# Altium project CPU_v1.PrjPCB (part 2 of 2)

## Sheet USB_OTG_FS.SchDoc: USB_OTG_FS
size A4; DocumentNumber: MB1246; Revision: B.1; SheetNumber: 9; SheetTotal: 17; Project: STM32H7xxI-EVAL
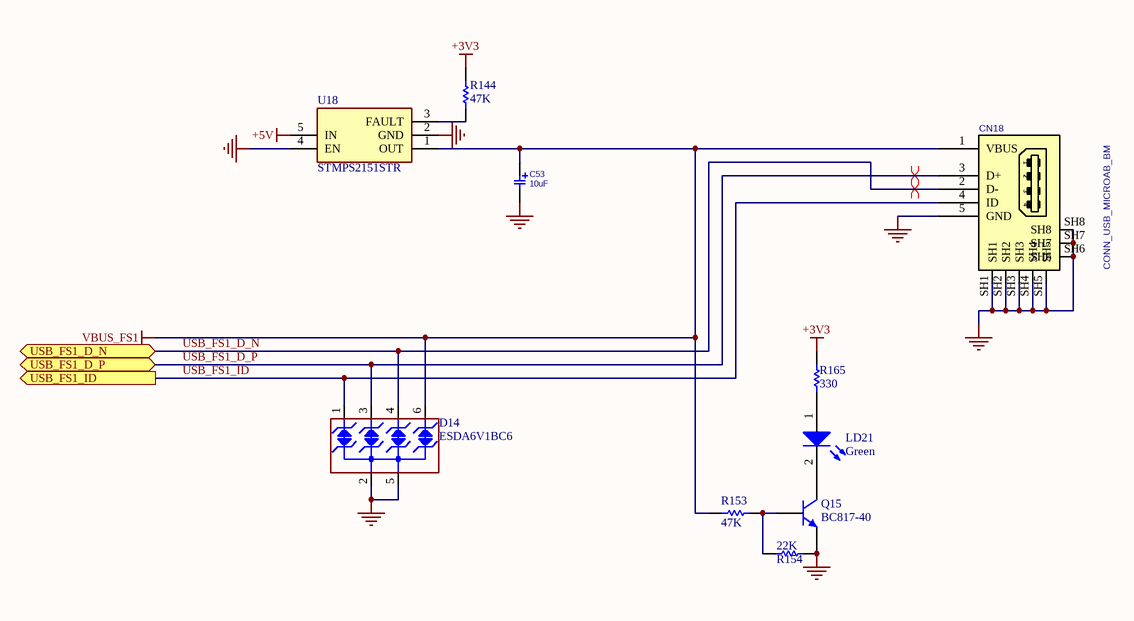
[diagram p8: USB_OTG_FS.SchDoc]

### Parts
C53  10uF  [C_TN_3216]
CN18  CONN_USB_MICROAB_BM  [USB_MICRO_AB_BM_SHT]
D14  ESDA6V1BC6  [SOT95P280X145-6N]
LD21  Green  [LED0603GRN]
Q15  BC817-40  [SOT-23-3]
R144  47K  [R0603E]
R153  47K  [R0603E]
R154  22K  [R0603E]
R165  330  [R0603E]
U18  STMPS2151STR  [SOT95P280X145-5N]

### Ports
USB_FS1_D_N (bidir), USB_FS1_D_P (bidir), USB_FS1_ID (out)

### Nets
+3V3: R144.1 R165.2
+5V: U18.5(IN)
GND: C53.2 CN18.5(GND) CN18.SH1 CN18.SH2 CN18.SH3 CN18.SH4 CN18.SH5 CN18.SH6 CN18.SH7 CN18.SH8 D14.2(IO2) D14.5(IO4) Q15.2(E) R154.1 U18.2(GND) U18.4(EN)
VBUS_FS1: C53.1 CN18.1(VBUS) D14.6(NC) R153.1 U18.1(OUT)
USB_FS1_D_N: CN18.2(D-) D14.4(IO3) ; port USB_FS1_D_N
USB_FS1_D_P: CN18.3(D+) D14.3(GND) ; port USB_FS1_D_P
USB_FS1_ID: CN18.4(ID) D14.1(IO1) ; port USB_FS1_ID
NetLD21_1: LD21.1(A) R165.1
NetLD21_2: LD21.2(K) Q15.3(C)
NetQ15_1: Q15.1(B) R153.2 R154.2
NetR144_2: R144.2 U18.3(FAULT)

### Layout directives
differential pair: USB_FS1_D_N, USB_FS1_D_P

### Notes on the sheet
- Title:
- Project:
- Size:
- Date:
- A4
- Reference:
- Sheet:
- Revision:
- of

### Library data of the parts
C53 = CAP_SMD_TAN_10uF_6.3V: CAP, SMD, TAN; PARAM: 20%, 300mOhm, -55~105oC; MANF: VISHAY; MANF_P#: T55A106M6R3C0300; PARAM2: 6.3V; PRICE: 0.46$; VALUE: 10uF
CN18 = CONN_USB_MICRO_AB_BM_SHT: CONN, USB, MICRO AB, R/A, SMD, BOTTOM MOUNT; MANF_P#: 47589-0001; MANF: MOLEX; PARAM2: 30VAC; PARAM: 1.8A, -20~85oC; MANF_P#2: HIROSE ZX62D-AB-5P8; PRICE: 0.75$; VALUE: CONN_USB_MICROAB_BM
D14 = ESDA6V1BC6: 4-line ESD protection; Manuf_1: STM; Manuf_Part_1: ESDA5V3L; Ref St: 9179034; Provided: ST; ECCN_US/EU: EAR99/NEC; Distrib: ST; Order: ESDA5V3L; Ordered by: STM
LD21 = LED2: Typical RED, GREEN, YELLOW, AMBER GaAs LED; Published: 8-Jun-2000; Revision: July-2002: Re-released for DXP Platform.; Publisher: Altium Limited
Q15 = BC817-40: TRANS NPN 300V 0.3A SOT23; Manufacturer: Micro Commercial Co; Manufacturer Part Number: MMBTA42-TP; Current Footprint: TO-236-3, SC-59, SOT-23-3; PCB Name: GS-101; Board Qty: 1000; ITEM/NO: 71; Vce Saturation (Max) @ Ib, Ic: 500mV @ 2mA, 20mA; DC Current Gain (hFE) (Min) @ Ic, Vce: 40 @ 30mA, 10V; Frequency - Transition: 50MHz; Current - Collector Cutoff (Max): 100nA (ICBO); HelpURL: D:\HNA\Datasheet Documents\MMBTA42(SOT-23).pdf; Part Number: BC817-40; Size / Dimension: NULL; Supplier: Digi-Key; Mounting Type: Surface Mount; Base Part Number: MMBTA42; Supplier Device Package: SOT-23; Part Status: Active; RoHS: RoHS Compliant; Category: Discrete Semiconductor Products; Supplier Part Number: MMBTA42TPMSCT-ND; Operating Temperature: -55°C ~ 150°C (TJ); Package / Case: TO-236-3, SC-59, SOT-23-3; Transistor Type: NPN; Packaging: Cut Tape (CT); Pricing: 1=0.22, 10=0.203, 25=0.146, 100=0.1136, 250=0.07136, 500=0.06084, 1000=0.04137 (USD); Stock: 49544
R144 R153 R154 R165 = res1: Resistor; Value: 1K; Published: 8-Jun-2000; Revision: July-2002: Re-released for DXP Platform.; Publisher: Altium Limited
U18 = STMPS2151STR: Integrated Circuit; Manufacturer_Name: ST; Datasheet Link: https://www.st.com/resource/en/datasheet/stmps2141.pdf; Height: 1.45mm; Manufacturer_Part_Number: STMPS2151STR

## Sheet MCU2_USB.SchDoc: USB_OTG_FS
size A4; DocumentNumber: MB1246; Revision: B.1; SheetNumber: 9; SheetTotal: 17; Project: STM32H7xxI-EVAL
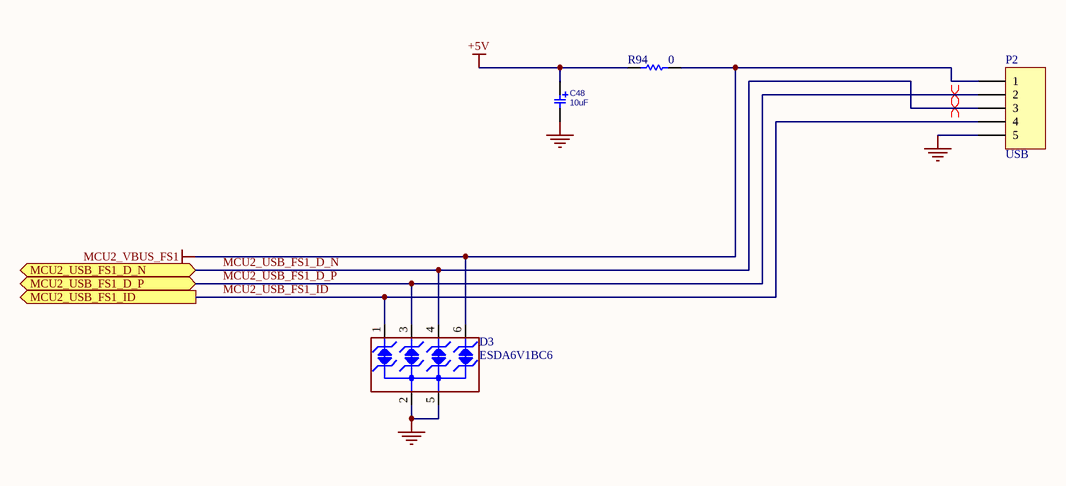
[diagram p9: MCU2_USB.SchDoc]

### Parts
C48  10uF  [C_TN_3216]
D3  ESDA6V1BC6  [SOT95P280X145-6N]
P2  USB  [xh-5]
R94  0  [R0603E]

### Ports
MCU2_USB_FS1_D_N (bidir), MCU2_USB_FS1_D_P (bidir), MCU2_USB_FS1_ID (out)

### Nets
+5V: C48.1 R94.2
GND: C48.2 D3.2(IO2) D3.5(IO4) P2.5
MCU2_VBUS_FS1: D3.6(NC) P2.1 R94.1
MCU2_USB_FS1_D_N: D3.4(IO3) P2.3 ; port MCU2_USB_FS1_D_N
MCU2_USB_FS1_D_P: D3.3(GND) P2.2 ; port MCU2_USB_FS1_D_P
MCU2_USB_FS1_ID: D3.1(IO1) P2.4 ; port MCU2_USB_FS1_ID

### Layout directives
differential pair: MCU2_USB_FS1_D_N, MCU2_USB_FS1_D_P

### Notes on the sheet
- Title:
- Project:
- Size:
- Date:
- A4
- Reference:
- Sheet:
- Revision:
- of

### Library data of the parts
C48 = CAP_SMD_TAN_10uF_6.3V: as C53 on sheet USB_OTG_FS; PRICE: 0.46$; VALUE: 10uF
D3 = ESDA6V1BC6: as D14 on sheet USB_OTG_FS; Distrib: ST; Order: ESDA5V3L; Ordered by: STM
P2 = Header 5: Header, 5-Pin; LatestRevisionDate: 17-Jul-2002; LatestRevisionNote: Re-released for DXP Platform.; Publisher: Altium Limited
R94 = Res1: Resistor; Value: 1K; Published: 8-Jun-2000; Revision: July-2002: Re-released for DXP Platform.; Publisher: Altium Limited

## Sheet GPS.SchDoc
size 254 x 228 mm; DocumentNumber: 12; SheetNumber: 12; SheetTotal: 15; PageSetup: Record=PageOptions|CenterHorizontal=True|CenterVertical=True|PrintScale=0.87|XCorrection=1.00|YCorrection=1.00|PrintKind=1|BorderSize=5000000|LeftOffset=0|BottomOffset=0|Orientation=2|PaperLength=1000|PaperWidth=1000|Scale=100|PaperSource=257|PrintQuality=600|MediaType=1|DitherType=10|PrintScaleMode=1|PaperKind=A4|PaperIndex=9
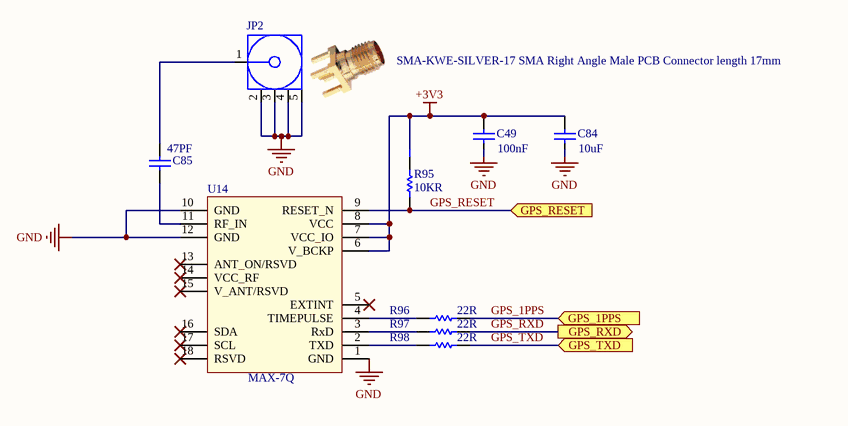
[diagram p10: GPS.SchDoc]

### Parts
C49  100nF  [C0603E]
C84  10uF  [C0805E]
C85  47PF  [C0603E]
JP2  SMA-KWE-SILVER-17 SMA Right Angle Male PCB Connector length 17mm  [SMA_R]
R95  10KR  [R0603E]
R96  22R  [R0603E]
R97  22R  [R0603E]
R98  22R  [R0603E]
U14  Part Number: MAX-7Q  [MAX]  (hidden comment: GPS_MAX-7Q)

### Ports
GPS_1PPS (in), GPS_RESET (in), GPS_RXD (out), GPS_TXD (in)

### Nets
+3V3: C49.1 C84.1 R95.2 U14.6(V_BCKP) U14.7(VCC_IO) U14.8(VCC)
GND: C49.2 C84.2 JP2.2(GND) JP2.3(GND) JP2.4(GND) JP2.5(GND) U14.1(GND) U14.10(GND) U14.12(GND)
GPS_1PPS: R96.2 ; port GPS_1PPS
GPS_RESET: R95.1 U14.9(RESET_N) ; port GPS_RESET
GPS_RXD: R97.2 ; port GPS_RXD
GPS_TXD: R98.2 ; port GPS_TXD
NetC85_1: C85.1 JP2.1(Signal)
NetC85_2: C85.2 U14.11(RF_IN)
NetR96_1: R96.1 U14.4(TIMEPULSE)
NetR97_1: R97.1 U14.3(RxD)
NetR98_1: R98.1 U14.2(TXD)

Not connected (* = marked no-connect by the designer): U14 5(EXTINT)* 13(ANT_ON/RSVD)* 14(VCC_RF)* 15(V_ANT/RSVD)* 16(SDA)* 17(SCL)* 18(RSVD)*

### Library data of the parts
C49 C85 = Cap: Chip Monolithic Ceramic Capacitor; SMD; Manufacturer: Murata Electronics North America; Manufacturer Part Number: GRM188R71C104KA01D; Current Footprint: 0603 (1608 Metric); Board Qty: 100; PCB Name: Main_PCB; Packing List: CL10B104KB8NNNC; ComponentLink1Description: Datasheet; HelpURL: D:\HNA\Datasheet Documents\c02e.pdf; ComponentLink1URL: D:\HNA\Datasheet Documents\c02e.pdf; Mounting Type: Surface Mount; Supplier: NULL; Supplier Part Number: NULL; Pricing: NULL; Package / Case: 0603 (1608 Metric); Size / Dimension: NULL; Description1: Chip Monolithic Ceramic Capacitor; SMD
  C49: Part Number: 100nF
  C85: Part Number: 47PF
C84 = Cap: Chip Monolithic Ceramic Capacitor; SMD; Manufacturer: Murata Electronics North America; Manufacturer Part Number: GRM188R71C104KA01D; Current Footprint: 0805 (2012 Metric); Board Qty: 100; PCB Name: Main_PCB; Packing List: CL10B104KB8NNNC; ComponentLink1Description: Datasheet; HelpURL: D:\HNA\Datasheet Documents\c02e.pdf; ComponentLink1URL: D:\HNA\Datasheet Documents\c02e.pdf; Mounting Type: Surface Mount; Supplier: NULL; Part Number: 10uF; Supplier Part Number: NULL; Pricing: NULL; Package / Case: 0805 (2012 Metric); Size / Dimension: NULL; Description1: Chip Monolithic Ceramic Capacitor; SMD
JP2 = 19-46-2-TGG: CONN RP-SMA JACK R/A 50 OHM PCB MALE PIN-SILVER; Manufacturer-1: Linx Technologies Inc.; Manufacturer Part Number-1: CONREVSMA002-L; Manufacturer: China; Manufacturer Part Number: SMA-KWE-17 SMA Right Angle Male PCB Connector length 17mm; Current Footprint: THD; Board Qty: 100; Impedance: 50 Ohm; Contact Termination: Solder; Connector Type: Receptacle, Male Pin; Center Contact Material: Brass; Body Finish: Nickel; Dielectric Material: Polytetrafluoroethylene (PTFE); Center Contact Plating: Gold; Package / Case: THD; Part Number-1: CONREVSMA002-L; Pricing: 1=4.12, 25=3.8, 100=3.43, 500=3.25 (USD); Supplier: Digi-Key; Supplier Part Number: CONREVSMA002-L-ND; HelpURL: D:\HNA\Datasheet Documents\conrevsma002-l.pdf; Category: Connectors, Interconnects; RoHS: RoHS Compliant; Packaging: Bulk; Part Status: Active; Connector Style: RP-SMA; Frequency - Max: -; Mounting Type: Panel Mount, Bulkhead; Through Hole, Right Angle; Features: -; Housing Color: Silver; Cable Group: -; Shield Termination: Solder; Fastening Type: Threaded; Voltage Rating: -; Ingress Protection: -; Operating Temperature: -65°C ~ 165°C; Body Material: Brass; Stock: 11366; Part Number: SMA-KWE-SILVER-17 SMA Right Angle Male PCB Connector length 17mm
R95-R98 = Res1: Resistor: thick film; SMD; Manufacturer: Yageo; Manufacturer Part Number: null; Current Footprint: 0603 (1608 Metric); Board Qty: 100; PCB Name: Main_PCB; Packing List: 0603F1002T5E; ComponentLink1Description: Datasheet; HelpURL: D:\HNA\Datasheet Documents\PYu-RC_Group_51_RoHS_L_0.pdf; ComponentLink1URL: D:\HNA\Datasheet Documents\PYu-RC_Group_51_RoHS_L_0.pdf; Mounting Type: Surface Mount; Supplier: NULL; Supplier Part Number: NULL; Pricing: NULL; Description1: Resistor: thick film; SMD; Package / Case: 0603 (1608 Metric); Size / Dimension: NULL
  R95: Part Number: 10KR
  R96-R98: Part Number: 22R
U14 = MAX: GPS chip module EPP0910; Manufacturer-1: ShenZhen Tifull Technology Ltd.; Manufacturer Part Number-1: TF1097U7M3; Manufacturer: NULL; Current Footprint: SMD; PCB Name: Main_PCB; Package / Case: SMD; Part Number-1: MAX-7Q; Pricing: 1=12.00000, 100=12.00000 (USD); Size / Dimension: NULL; Supplier: Octopart; Supplier Part Number: Seeed Studio - 317050009; HelpURL: D:\HNA\Datasheet Documents\u-blox-MAX-7_DataSheet_(GPS.G7-HW-12012)_2.pdf; Part Number-2: TF1097U7M3; Manufacturer Part Number: NULL

## Sheet LCDTFT_FPC45P_RGB.SchDoc
size A3; SheetNumber: 14; SheetTotal: 27
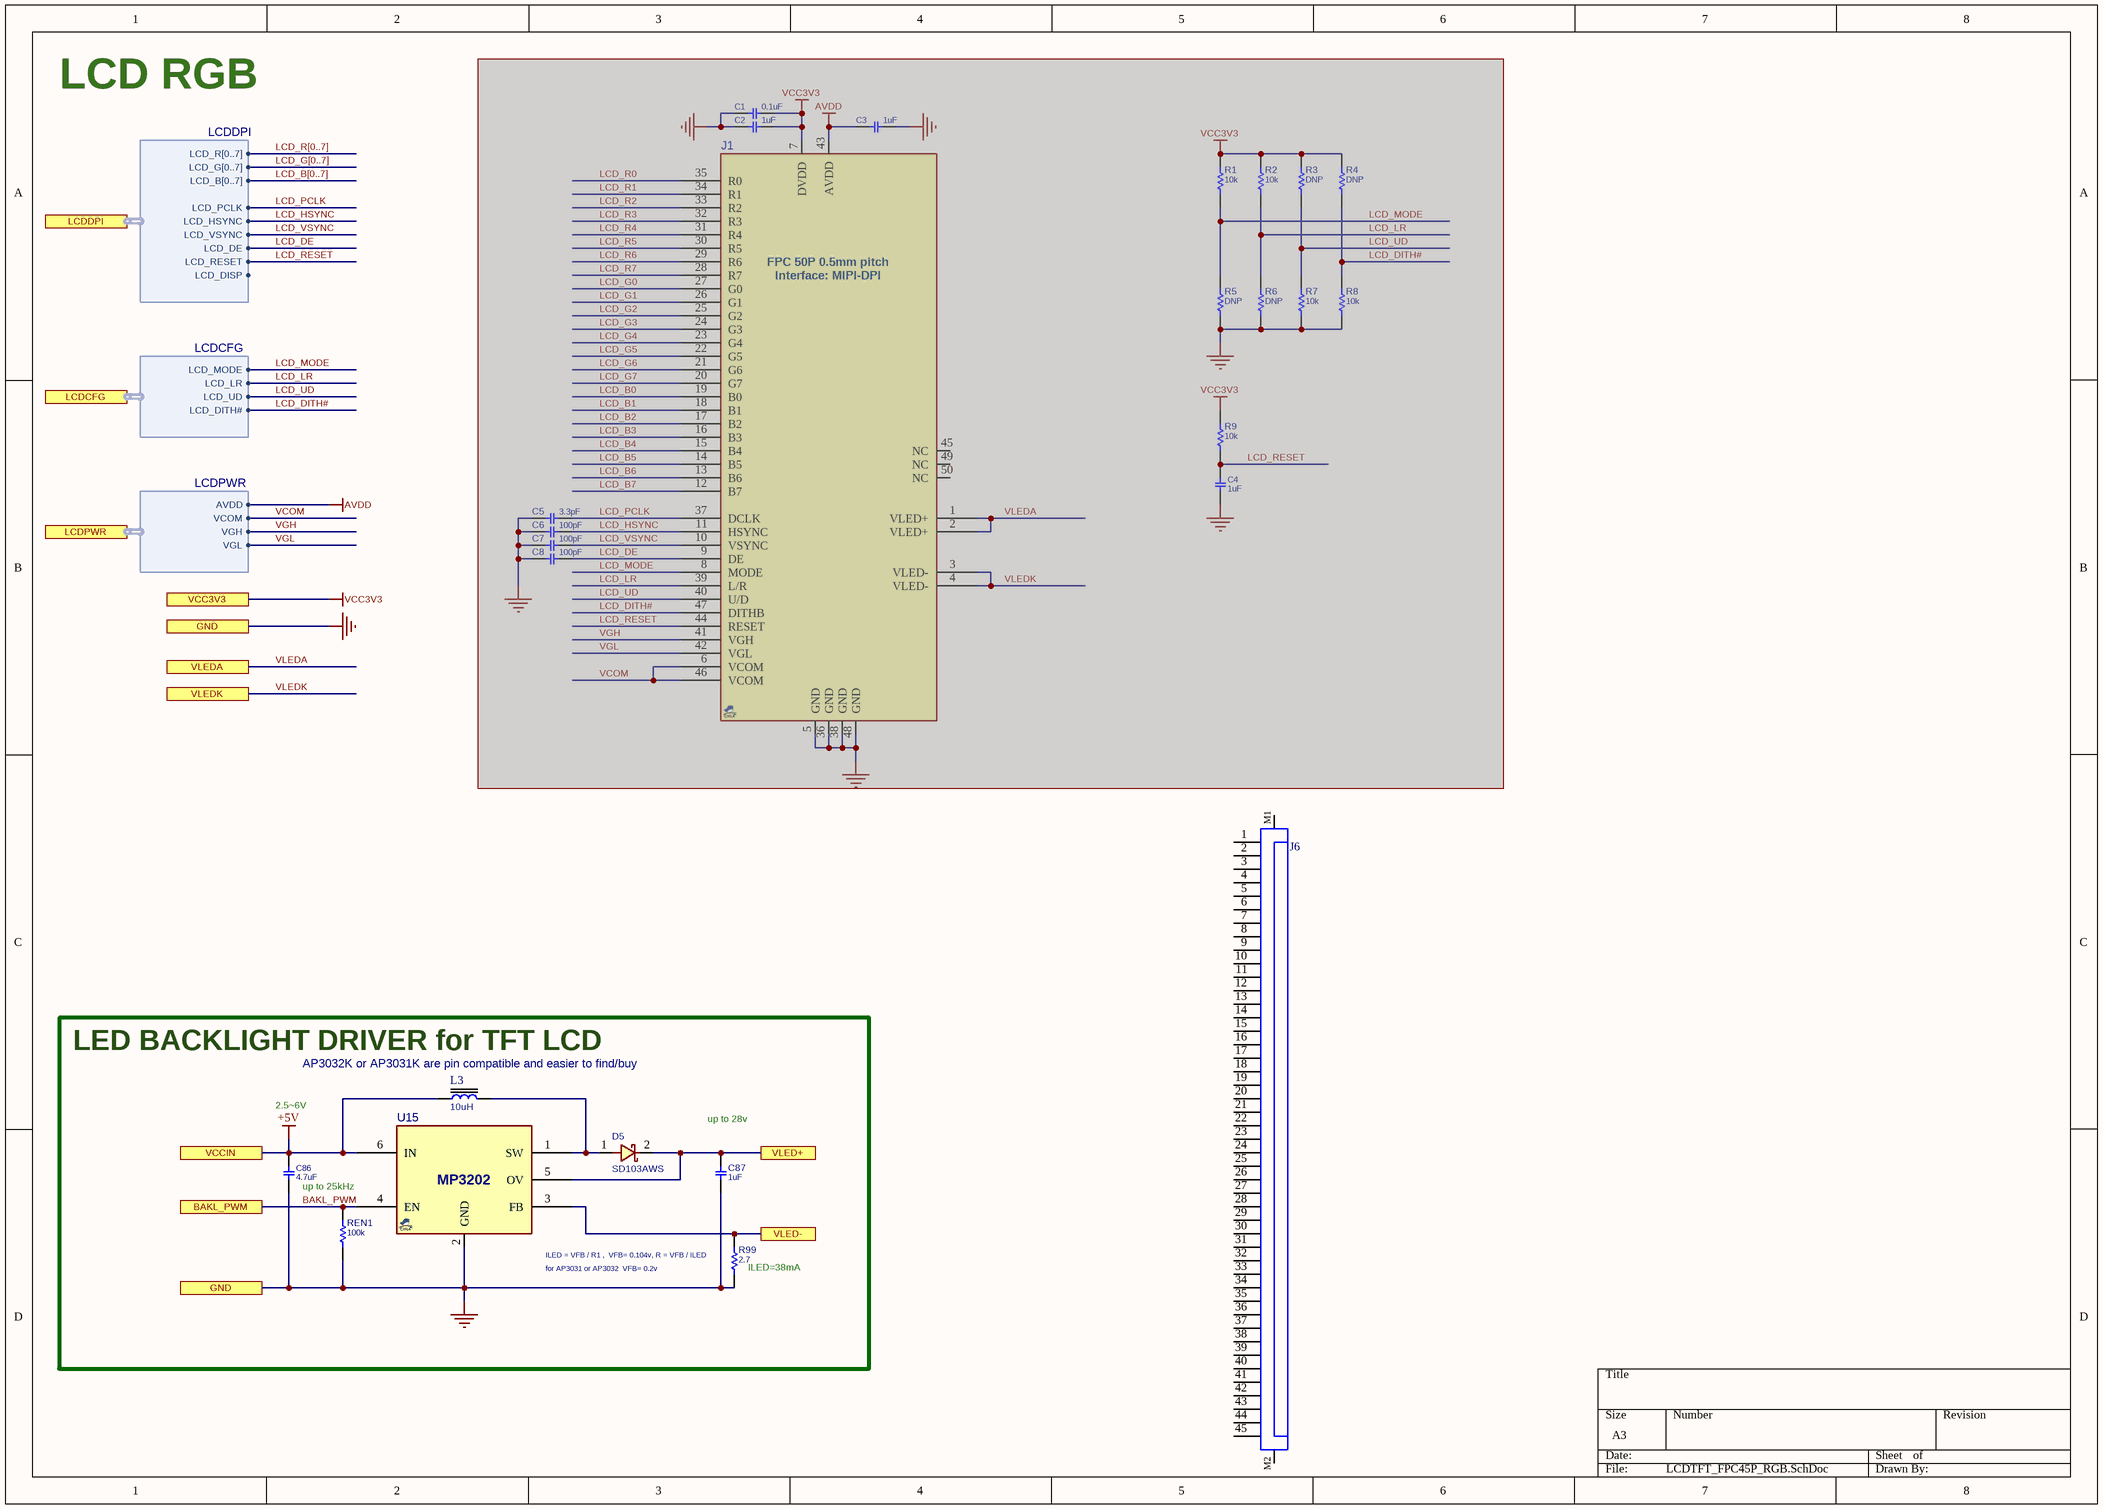
[diagram p11: LCDTFT_FPC45P_RGB.SchDoc]

### Parts
(Parts that share a designator on the sheet are numbered #1, #2 ... from top to bottom, then left to right.)
C1#2  0.1uF  [C0402]  (masked out: inside a compile mask, not in the netlist)
C2#2  1uF  [C0402]  (masked out: inside a compile mask, not in the netlist)
C3#2  1uF  [C0402]  (masked out: inside a compile mask, not in the netlist)
C4#2  1uF  [C0402]  (masked out: inside a compile mask, not in the netlist)
C5#2  3.3pF  [C0402]  (masked out: inside a compile mask, not in the netlist)
C6#2  100pF  [C0402]  (masked out: inside a compile mask, not in the netlist)
C7#2  100pF  [C0402]  (masked out: inside a compile mask, not in the netlist)
C8#2  100pF  [C0402]  (masked out: inside a compile mask, not in the netlist)
C86  4.7uF  [C0603E]
C87  1uF  [C0603E]
D5  SD103AWS  [D_SOD323]
J1#2  FPC_50_0.5mm  [FPC50_50D_FFC2B29]  (value not drawn)  (masked out: inside a compile mask, not in the netlist)
J6  68714514022  [68714514022]  (value not drawn)
L3  10uH  [L_4]
R1#2  10k  [R0402]  (masked out: inside a compile mask, not in the netlist)
R2#2  10k  [R0402]  (masked out: inside a compile mask, not in the netlist)
R3#2  DNP  [R0402]  (masked out: inside a compile mask, not in the netlist)
R4#2  DNP  [R0402]  (masked out: inside a compile mask, not in the netlist)
R5#2  DNP  [R0402]  (masked out: inside a compile mask, not in the netlist)
R6#2  DNP  [R0402]  (masked out: inside a compile mask, not in the netlist)
R7#2  10k  [R0402]  (masked out: inside a compile mask, not in the netlist)
R8#2  10k  [R0402]  (masked out: inside a compile mask, not in the netlist)
R9#2  10k  [R0402]  (masked out: inside a compile mask, not in the netlist)
R99  2.7  [R0603E]
REN1  100k  [R0603E]
U15  (no value)  [SOT23_6]

### Blocks framed on the sheet
LED BACKLIGHT DRIVER for TFT LCD: C86 C87 D5 L3 R99 REN1 U15

### Ports
BAKL_PWM, GND, LCDCFG (harness LCDCFG), LCDDPI (harness LCDDPI), LCDPWR (harness LCDPWR), VCC3V3, VCCIN, VLED+, VLED-, VLEDA, VLEDK

### Harnesses
LCDDPI: LCD_PCLK, LCD_HSYNC, LCD_VSYNC, LCD_DE, LCD_R[0..7], LCD_G[0..7], LCD_B[0..7], LCD_RESET, LCD_DISP
LCDPWR: AVDD, VGH, VCOM, VGL
LCDCFG: LCD_MODE, LCD_LR, LCD_UD, LCD_DITH#

### Nets
+5V: C86.2 L3.1 U15.6(IN) ; port VCCIN
AVDD: port LCDPWR.AVDD
GND: C86.1 C87.1 R99.2 REN1.2 U15.2(GND) ; port GND
VCC3V3: port VCC3V3
BAKL_PWM: REN1.1 U15.4(EN) ; port BAKL_PWM
LCD_DE: port LCDDPI.LCD_DE
LCD_DITH#: port LCDCFG.LCD_DITH#
LCD_HSYNC: port LCDDPI.LCD_HSYNC
LCD_LR: port LCDCFG.LCD_LR
LCD_MODE: port LCDCFG.LCD_MODE
LCD_PCLK: port LCDDPI.LCD_PCLK
LCD_RESET: port LCDDPI.LCD_RESET
LCD_UD: port LCDCFG.LCD_UD
LCD_VSYNC: port LCDDPI.LCD_VSYNC
VCOM: port LCDPWR.VCOM
VGH: port LCDPWR.VGH
VGL: port LCDPWR.VGL
VLEDA: port VLEDA
VLEDK: port VLEDK
NetC87_2: C87.2 D5.2 U15.5(OV) ; port VLED+
NetD5_1: D5.1 L3.2 U15.1(SW)
NetR99_1: R99.1 U15.3(FB) ; port VLED-

Not connected (* = marked no-connect by the designer): J6 1 2 3 4 5 6 7 8 9 10 11 12 13 14 15 16 17 18 19 20 21 22 23 24 25 26 27 28 29 30 31 32 33 34 35 36 37 38 39 40 41 42 43 44 45 M1 M2

### Buses and harness runs
bus LCD_B[0..7]
bus LCD_G[0..7]
bus LCD_R[0..7]

### Notes on the sheet
- LCD RGB
- 2.5~6V
- (near L3) AP3032K or AP3031K are pin compatible and easier to find/buy
- (near C87) up to 28v
- (near C86) up to 25kHz
- ILED = VFB / R1 ,  VFB= 0.104v, R = VFB / ILED
- (near U15) for AP3031 or AP3032  VFB= 0.2v
- (near R99) ILED=38mA
- (in symbol LCDTFT_DPI_FPC50P) FPC 50P 0.5mm pitch; Interface: MIPI-DPI
- (in symbol VREG_MP3202_SOT23) MP3202

### Library data of the parts
C1#2 = CAP_SMD_MLCC: CAP, MLCC; PARAM: X7R, 10%, -55~125oC; MANF_P#: GRM155R71H104KE14D; MANF: Murata; PARAM2: 50v; PRICE: 100: 0.018$; ASSEMBLY: ASSEMBLY; VALUE: 0.1uF
C2#2 C3#2 C4#2 = CAP_SMD_MLCC: CAP, MLCC; PARAM: X5R, 10%; MANF_P#: CL05A105KO5NNND; MANF: Samsung; PARAM2: 16v; PRICE: 50,000:	$0.006; ASSEMBLY: ASSEMBLY; VALUE: 1uF
C5#2 C6#2 C7#2 C8#2 = CAP_SMD_MLCC: CAP, MLCC; PARAM: X5R, 10%; PARAM2: 50v; PRICE: 50,000:	$0.006; MANF_P#: -; MANF: -; ASSEMBLY: ASSEMBLY
  C5#2: VALUE: 3.3pF
  C6#2 C7#2 C8#2: VALUE: 100pF
C86 = CAP_SMD_MLCC: CAP, MLCC; PARAM: X5R, 10%; MANF_P#: CL05A475MP5NRNC; MANF: Samsung; PARAM2: 10v; PRICE: 10,000:	$0.013; ASSEMBLY: ASSEMBLY; VALUE: 4.7uF
C87 = CAP_SMD_MLCC: CAP, MLCC; PARAM: X5R, 10%; MANF_P#: CL10A105KB8NNNC; MANF: Samsung; PARAM2: 50v; PRICE: 50,000:	$0.006; ASSEMBLY: ASSEMBLY; VALUE: 1uF
D5 = DIODE_SMD_SCHOTTKY_1N5819: DIODE, SCHOTTKY, 40V, 2A; MANF: DIODES; DESC: DESCRIPTION; MANF_P#: SD103AWS; ASSEMBLY: ASSEMBLY; PRICE: PRICE; PARAM2: 2A; PARAM: 40V; VALUE: SD103AWS
J1#2 = LCDTFT_DPI_FPC50P: LCD TFT Color, FPC50P, RGB; MANF: -; MANF_P#: -; PARAM: -; VALUE: FPC_50_0.5mm
J6 = 68714514022: WR-FPC SMT ZIF Horizontal Top Contact, pitch 0.5mm, Horizontal, 45pins; Manufacturer: Wurth Elektronik; Contact Resistance: 20mOhm; Rated Current: 0.5A; Working Voltage: 50VAC; Manufacturer Part Number: 68714514022; Category: FPC Connectors; Match Code: WR-FPC; ComponentLink1Description: Website Link; ComponentLink1URL: https://www.we-online.com/redexpert/article/68714514022?ad; ComponentLink2Description: Datasheet Link; ComponentLink2URL: https://www.we-online.com/redexpert/spec/68714514022?ad; Mount: Surface Mount; Operating Temperature Max: 85°C; Operating Temperature Min: -25°C; Packaging: Tape and Reel; Length: 28.9mm; Width: 5.1mm; Height: 2.1mm; Number of Pins: 45; Orientation: Horizontal; Pitch: 0.5mm
L3 = INDPWR_SMD: INDUCTOR, POWER, SMD; MANF_P#: GCD43-100MC; VALUE: 10uH
R1#2 R2#2 R3#2 R4#2 R5#2 R6#2 R7#2 R8#2 R9#2 = RES_SMD: RESISTOR, SMD; PARAM: 0.063W; DESC: DESCRIPTION; DIST#: MOUSER; PARAM2: 1%; MANF_P#: -; MANF: -; ASSEMBLY: ASSEMBLY; PRICE: 100= 0.3$
  R1#2 R2#2 R7#2 R8#2 R9#2: VALUE: 10k
  R3#2 R4#2 R5#2 R6#2: VALUE: DNP
R99 REN1 = RES_SMD: RESISTOR, SMD, 20K, 0402; MANF: Yageo; PARAM: 0.063W; DIST#: MOUSER; PARAM2: 1%; MANF_P#: RK73H1ETTP2002F; ASSEMBLY: ASSEMBLY; PRICE: 100= 0.5$; DESC: RESISTOR, SMD, 20K, 0402
  R99: VALUE: 2.7
  REN1: VALUE: 100k
U15 = VREG_MP3202_SOT23: REG, Switching, Boost, 1.3A, ADJ, 1MHz, SOT-23-6; PARAM: 1.3A, 1MHz; PARAM2: 2.5~6Vin; MANF_P#: MP3202DJ; MANF: MPS

## Sheet OpticDiodes+LEDs.SchDoc
size A3
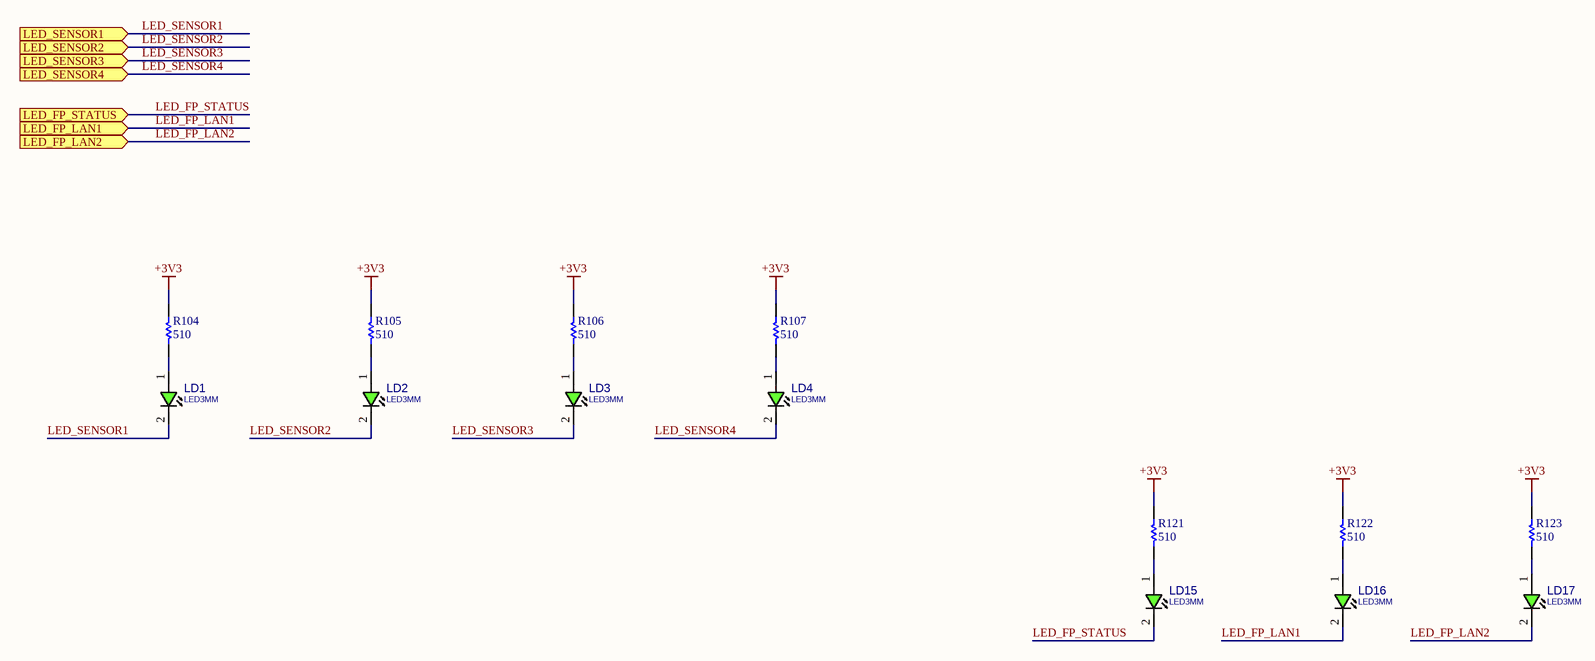
[diagram p12: OpticDiodes+LEDs.SchDoc]

### Parts
LD1  LED3MM  [LED3MM]
LD2  LED3MM  [LED3MM]
LD3  LED3MM  [LED3MM]
LD4  LED3MM  [LED3MM]
LD15  LED3MM  [LED3MM]
LD16  LED3MM  [LED3MM]
LD17  LED3MM  [LED3MM]
R104  510  [R0603E]
R105  510  [R0603E]
R106  510  [R0603E]
R107  510  [R0603E]
R121  510  [R0603E]
R122  510  [R0603E]
R123  510  [R0603E]

### Ports
LED_FP_LAN1 (in), LED_FP_LAN2 (in), LED_FP_STATUS (in), LED_SENSOR1 (in), LED_SENSOR2 (in), LED_SENSOR3 (in), LED_SENSOR4 (in)

### Nets
+3V3: R104.1 R105.1 R106.1 R107.1 R121.1 R122.1 R123.1
LED_FP_LAN1: LD16.2(CATHODE) ; port LED_FP_LAN1
LED_FP_LAN2: LD17.2(CATHODE) ; port LED_FP_LAN2
LED_FP_STATUS: LD15.2(CATHODE) ; port LED_FP_STATUS
LED_SENSOR1: LD1.2(CATHODE) ; port LED_SENSOR1
LED_SENSOR2: LD2.2(CATHODE) ; port LED_SENSOR2
LED_SENSOR3: LD3.2(CATHODE) ; port LED_SENSOR3
LED_SENSOR4: LD4.2(CATHODE) ; port LED_SENSOR4
NetLD1_1: LD1.1(ANODE) R104.2
NetLD2_1: LD2.1(ANODE) R105.2
NetLD3_1: LD3.1(ANODE) R106.2
NetLD4_1: LD4.1(ANODE) R107.2
NetLD15_1: LD15.1(ANODE) R121.2
NetLD16_1: LD16.1(ANODE) R122.2
NetLD17_1: LD17.1(ANODE) R123.2

### Library data of the parts
LD1-LD4 LD15-LD17 = LED_THD_3MM: LED, THD, 3MM, GREEN; DESC: DESCRIPTION; MANF_P#: MANF_PART#; PARAM2: 2.2V; MANF: MANF; ASSEMBLY: ASSEMBLY; PRICE: PRICE; VALUE: LED3MM
R104-R107 R121-R123 = Res1: Resistor: thick film; SMD; Manufacturer: Vishay or Panasonic; Manufacturer Part Number: NULL; Board Qty: 1000; Current Footprint: 0603 (1608 Metric); Value: 4.7KR; PCB Name: GS-101; ITEM/NO: 15; Part Number: 510; ComponentLink1Description: Datasheet; ComponentLink1URL: D:\HNA\Datasheet Documents\Resistor-Chip-UniOhm.pdf; Description1: Resistor: thick film; SMD; HelpURL: D:\HNA\Datasheet Documents\Resistor-Chip-UniOhm.pdf; Mounting Type: Surface Mount, MLCC; Package / Case: 0603 (1608 Metric); Pricing: NULL; Supplier: NULL; Supplier Part Number: NULL; Size / Dimension: NULL

## Nets that join several sheets
+2V9_SD: Power (C47.1 R134.1 TP9.1 U17.4), SD card (13 pins)
+3V3: Power (12 pins), Ethernet (8 pins), FDCAN&QSPI (5 pins), USB_OTG_FS (R144.1 R165.2), GPS (6 pins), OpticDiodes+LEDs (7 pins)
+5V: Power (7 pins), FDCAN&QSPI (C100.1 U11.3), USB_OTG_FS (U18.5), MCU2_USB (C48.1 R94.2), LCDTFT_FPC45P_RGB (C86.2 L3.1 U15.6)
GND: MCU176_1 (150 pins), MCU176_2 (49 pins), Power (24 pins), Ethernet (24 pins), FDCAN&QSPI (7 pins), SD card (14 pins), USB_OTG_FS (16 pins), MCU2_USB (C48.2 D3.2 D3.5 P2.5), GPS (9 pins), LCDTFT_FPC45P_RGB (5 pins)
GND_IN: MCU176_1 (6 pins), Power (11 pins)
MCU2_VBUS_FS1: MCU176_2 (R63.1), MCU2_USB (D3.6 P2.1 R94.1)
VBUS_FS1: MCU176_1 (R15.1), USB_OTG_FS (5 pins)
VDD_MCU: MCU176_1 (38 pins), MCU176_2 (39 pins), Power (R1#1.1), SD card (C7#1.1 U4.5)
Vin_24V: MCU176_1 (6 pins), Power (C1#1.1 R6#1.1 R54.1 U9.1)
ADC_Vin: MCU176_1 (U1.57), Power (C54.1 D4.2 R10.2)
CAN_H: MCU176_1 (J2.a12 J2.c12), FDCAN&QSPI (R55.1)
CAN_L: MCU176_1 (J2.a14 J2.c14), FDCAN&QSPI (R56.1)
ETH_MDC: MCU176_1 (U1.33), Ethernet (U5.13)
ETH_MDIO: MCU176_1 (U1.42), Ethernet (R47.2)
FDCAN1_RX: MCU176_1 (U1.11), FDCAN&QSPI (U11.4)
FDCAN1_TX: MCU176_1 (U1.128), FDCAN&QSPI (U11.1)
GSYNC: MCU176_1 (6 pins), MCU176_2 (U2.20)
MCU1_SPI6_MISO: MCU176_1 (U1.52), MCU176_2 (U2.52)
MCU1_USART2_CK: MCU176_1 (U1.50), MCU176_2 (U2.151)
MCU1_USART2_RX: MCU176_1 (U1.47), MCU176_2 (U2.147)
MCU1_USART2_TX: MCU176_1 (U1.147), MCU176_2 (U2.150)
MCU2_RESET#: MCU176_1 (Q5.3), MCU176_2 (5 pins)
MCU2_USB_FS1_D_N: MCU176_2 (U2.122), MCU2_USB (D3.4 P2.3)
MCU2_USB_FS1_D_P: MCU176_2 (U2.123), MCU2_USB (D3.3 P2.2)
MCU2_USB_FS1_ID: MCU176_2 (U2.121), MCU2_USB (D3.1 P2.4)
MicroSDCard_Detect: MCU176_1 (U1.112), SD card (J4.13 R91.1)
QSPI_BK1_IO0: MCU176_1 (R18.2), MCU176_2 (R66.2), FDCAN&QSPI (R38.1)
QSPI_BK1_IO1: MCU176_1 (R29.2), MCU176_2 (R67.2), FDCAN&QSPI (R32.2)
QSPI_BK1_IO2: MCU176_1 (R17.2), MCU176_2 (R65.2), FDCAN&QSPI (R36.1)
QSPI_BK1_IO3: MCU176_1 (R16.2), MCU176_2 (R64.2), FDCAN&QSPI (R26.2)
QSPI_BK1_NCS: MCU176_2 (U2.79), FDCAN&QSPI (R19.1 U6.6 U6.7)
QSPI_BK2_IO0: MCU176_2 (R69.2), FDCAN&QSPI (R52.1)
QSPI_BK2_IO1: MCU176_2 (R70.2), FDCAN&QSPI (R28.2)
QSPI_BK2_IO2: MCU176_1 (R50.2), MCU176_2 (R72.2), FDCAN&QSPI (R33.1)
QSPI_BK2_IO3: MCU176_1 (R51.2), MCU176_2 (R73.2), FDCAN&QSPI (R27.2)
QSPI_CLK: MCU176_1 (R34.2), MCU176_2 (R68.2), FDCAN&QSPI (U6.13 U6.16)
RMII_CRS_DV: MCU176_1 (U1.53), Ethernet (R44.2)
RMII_REF_CLK: MCU176_1 (U1.41), Ethernet (R31.2)
RMII_RXD0: MCU176_1 (U1.54), Ethernet (R41.2)
RMII_RXD1: MCU176_1 (U1.55), Ethernet (R39.2)
RMII_TX_EN: MCU176_1 (U1.80), Ethernet (U5.16)
RMII_TXD0: MCU176_1 (U1.92), Ethernet (U5.17)
RMII_TXD1: MCU176_1 (U1.93), Ethernet (U5.18)
SDIO1_CLK: MCU176_1 (U1.141), SD card (U4.9)
SDIO1_CMD: MCU176_1 (U1.144), MCU176_2 (U2.144), SD card (U4.4)
SDIO1_D0: MCU176_1 (U1.117), SD card (U4.6)
SDIO1_D1: MCU176_1 (U1.118), SD card (U4.7)
USB_FS1_D_N: MCU176_1 (U1.122), USB_OTG_FS (CN18.2 D14.4)
USB_FS1_D_P: MCU176_1 (U1.123), USB_OTG_FS (CN18.3 D14.3)
USB_FS1_ID: MCU176_1 (U1.121), USB_OTG_FS (CN18.4 D14.1)